# Altium schematic sheet Power.SchDoc: Power
size B; DocumentNumber: 6; SheetNumber: 6; SheetTotal: 11
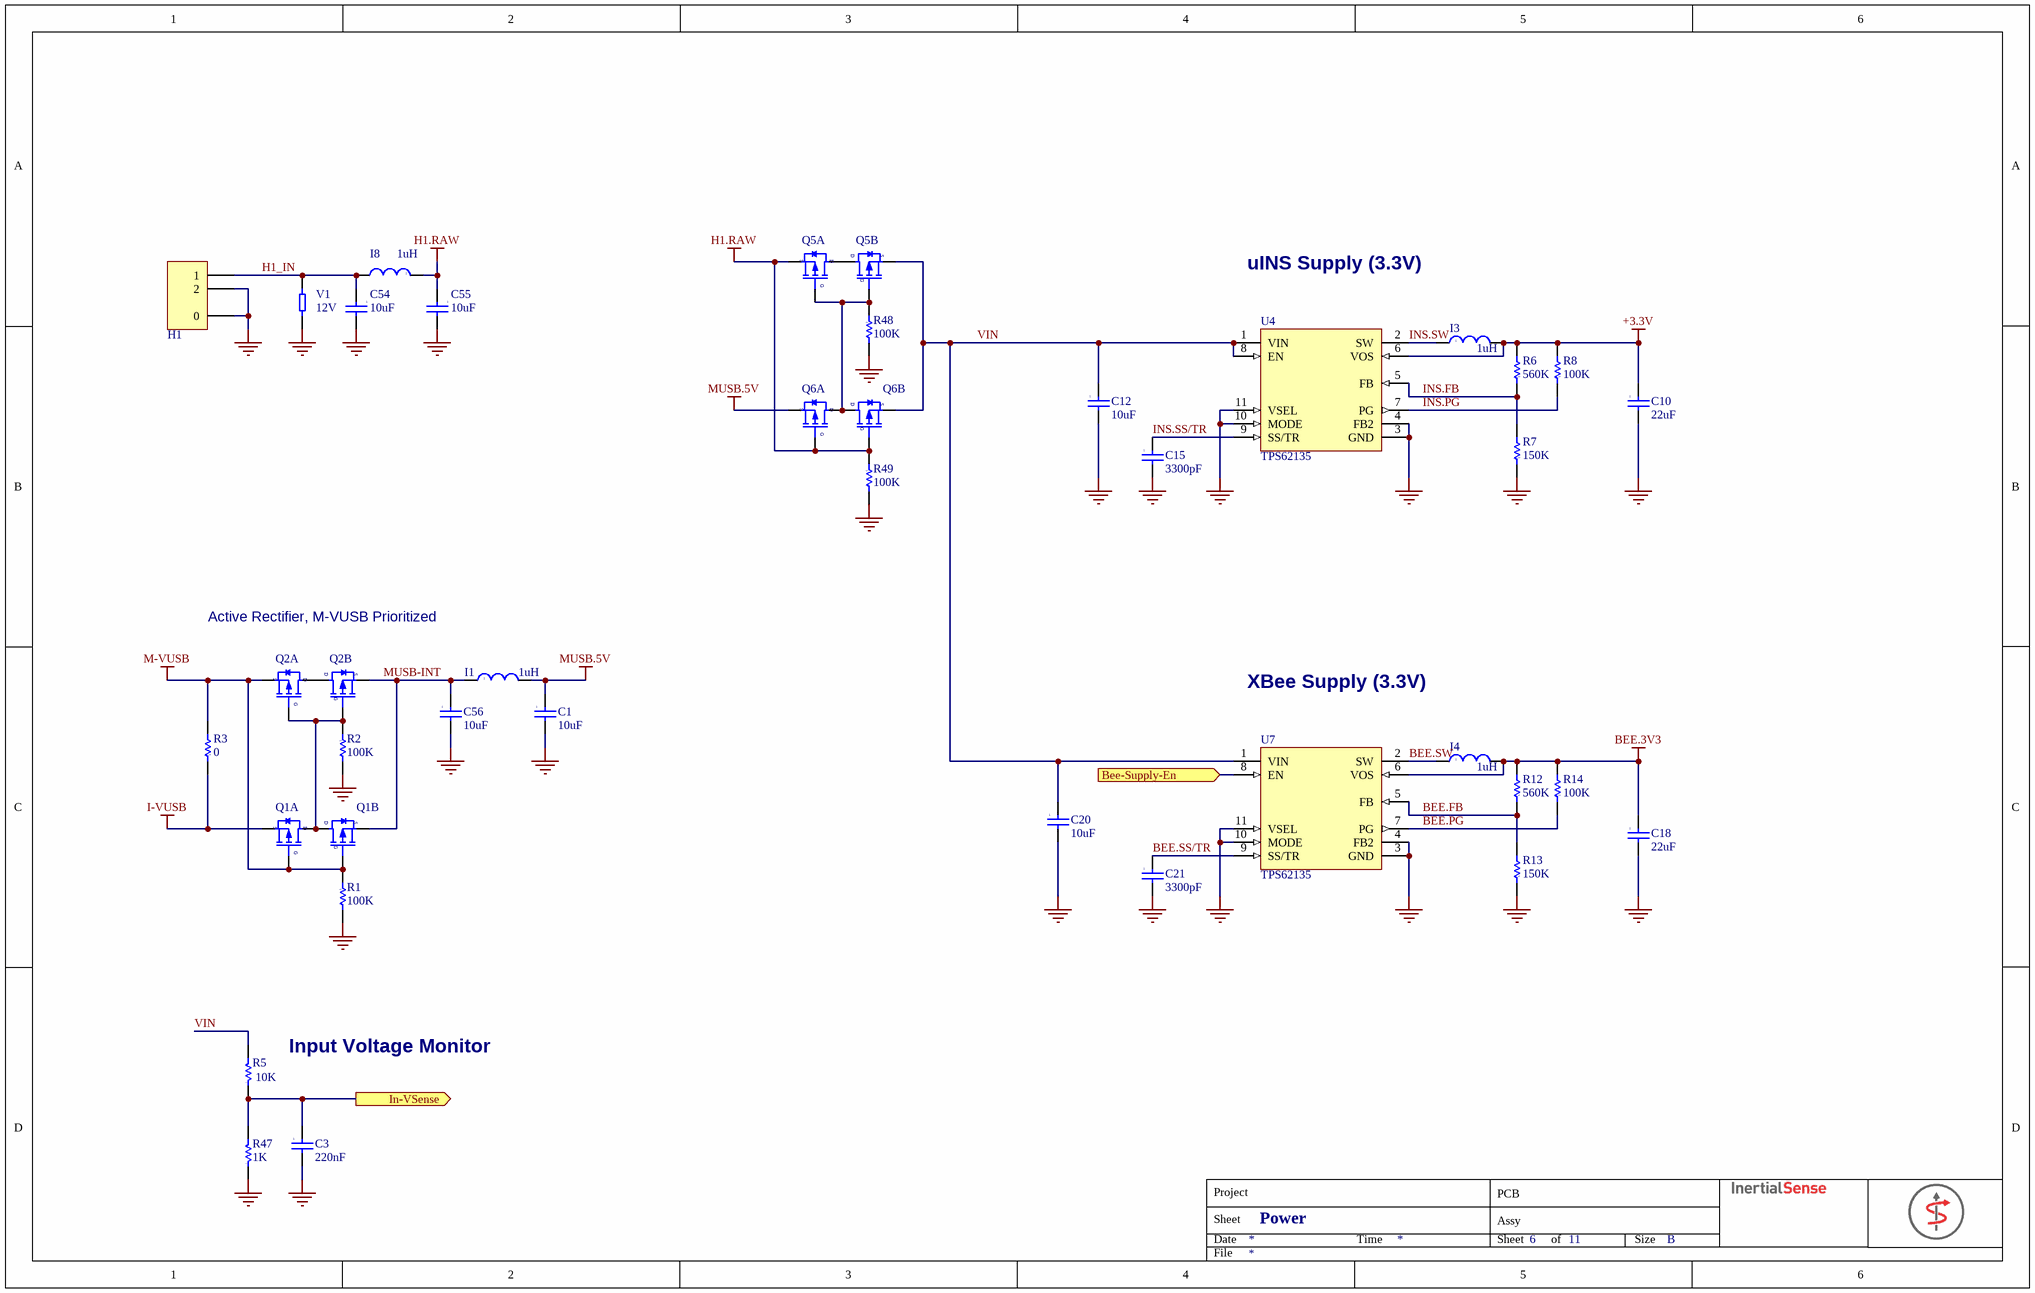
[diagram p0: Power.SchDoc]

## Parts
C1  value 10uF  [0805]  (hidden comment: Cap)
C3  value 220nF  [0402]  (hidden comment: Cap)
C10  value 22uF  [1206]  (hidden comment: Cap)
C12  value 10uF  [0805]  (hidden comment: Cap)
C15  value 3300pF  [0402]  (hidden comment: Cap)
C18  value 22uF  [1206]  (hidden comment: Cap)
C20  value 10uF  [0805]  (hidden comment: Cap)
C21  value 3300pF  [0402]  (hidden comment: Cap)
C54  value 10uF  [0805]  (hidden comment: Cap)
C55  value 10uF  [0805]  (hidden comment: Cap)
C56  value 10uF  [0805]  (hidden comment: Cap)
H1  Hdr - 2pin - mount  [S2B-PH-SM4-TB(LF)(SN)]  (value not drawn)
I1  value 1uH  [INDC2520X12N]  (hidden comment: Inductor)
I3  value 1uH  [INDC2520X12N]  (hidden comment: Inductor)
I4  value 1uH  [INDC2520X12N]  (hidden comment: Inductor)
I8  value 1uH  [INDC2520X12N]  (hidden comment: Inductor)
Q1  MOSFET-P  [TSST8]  (value not drawn)  (parts A,B of 2)
Q2  MOSFET-P  [TSST8]  (value not drawn)  (parts A,B of 2)
Q5  MOSFET-P  [TSST8]  (value not drawn)  (parts A,B of 2)
Q6  MOSFET-P  [TSST8]  (value not drawn)  (parts A,B of 2)
R1  value 100K  [R0402]  (hidden comment: Res)
R2  value 100K  [R0402]  (hidden comment: Res)
R3  value 0  [R0603]  (hidden comment: Res)
R5  value 10K  [R0402]  (hidden comment: Res)
R6  value 560K  [R0402]  (hidden comment: Res)
R7  value 150K  [R0402]  (hidden comment: Res)
R8  value 100K  [R0402]  (hidden comment: Res)
R12  value 560K  [R0402]  (hidden comment: Res)
R13  value 150K  [R0402]  (hidden comment: Res)
R14  value 100K  [R0402]  (hidden comment: Res)
R47  value 1K  [R0402]  (hidden comment: Res)
R48  value 100K  [R0402]  (hidden comment: Res)
R49  value 100K  [R0402]  (hidden comment: Res)
U4  TPS62135  [PQFN50P200X300X100-14N]
U7  TPS62135  [PQFN50P200X300X100-14N]
V1  Voltage Rating (DC): 12V  [R0402]  (hidden comment: Var)

## Ports
Bee-Supply-En (in), In-VSense (out)

## Nets
+3.3V: C10.1 I3.2 R6.2 R8.2 U4.6(VOS)
BEE.3V3: C18.1 I4.2 R12.2 R14.2 U7.6(VOS)
GND: C1.2 C3.2 C10.2 C12.2 C15.2 C18.2 C20.2 C21.2 C54.2 C55.2 C56.2 H1.0 H1.2 R1.2 R2.2 R7.1 R13.1 R47.1 R48.2 R49.2 U4.3(GND) U4.4(FB2) U4.10(MODE) U4.11(VSEL) U7.3(GND) U7.4(FB2) U7.10(MODE) U7.11(VSEL) V1.2
H1.RAW: C55.1 I8.1 Q5.S1(S) Q6.G1(G) Q6.G2(G) R49.1
I-VUSB: Q1.S1(S) R3.1
M-VUSB: Q1.G1(G) Q1.G2(G) Q2.S1(S) R1.1 R3.2
MUSB.5V: C1.1 I1.2 Q6.S1(S)
Bee-Supply-En: U7.8(EN) ; port Bee-Supply-En
BEE.FB: R12.1 R13.2 U7.5(FB)
BEE.PG: R14.1 U7.7(PG)
BEE.SS/TR: C21.1 U7.9(SS/TR)
BEE.SW: I4.1 U7.2(SW)
H1_IN: C54.1 H1.1 I8.2 V1.1
In-VSense: C3.1 R5.1 R47.2 ; port In-VSense
INS.FB: R6.1 R7.2 U4.5(FB)
INS.PG: R8.1 U4.7(PG)
INS.SS/TR: C15.1 U4.9(SS/TR)
INS.SW: I3.1 U4.2(SW)
MUSB-INT: C56.1 I1.1 Q1.S2(S) Q2.S2(S)
VIN: C12.1 C20.1 Q5.S2(S) Q6.S2(S) R5.2 U4.1(VIN) U4.8(EN) U7.1(VIN)
NetQ1_D1: Q1.D1(D) Q1.D2(D) Q2.G1(G) Q2.G2(G) R2.1
NetQ2_D1: Q2.D1(D) Q2.D2(D)
NetQ5_D1: Q5.D1(D) Q5.D2(D)
NetQ5_G1: Q5.G1(G) Q5.G2(G) Q6.D1(D) Q6.D2(D) R48.1

## Notes on the sheet
- uINS Supply (3.3V)
- Active Rectifier, M-VUSB Prioritized
- XBee Supply (3.3V)
- (near R5) Input Voltage Monitor
- Date
- Sheet
- Project
- Time
- PCB
- Assy
- of
- Size
- B
- File

## Library data of the parts
C1 C12 C20 C54-C56 = Cap: CAP CER 10UF 35V X5R 0805; Manufacturer: TDK; Manufacturer Part Number: C2012X5R1V106K085AC; Dielectric Material: Ceramic; Tolerance: 10%; Published: 8-Jun-2000; LatestRevisionDate: 17-Jul-2002; LatestRevisionNote: Re-released for DXP Platform.; Publisher: Altium Limited; Category: Capacitors; Supplier 1: Digi-Key; Supplier Part Number 1: 445-14417-6-ND; Stock 1: 0; Pricing 1: 1=0.83, 10=0.589, 100=0.3881, 500=0.2875, 1000=0.24438 (USD); Mount: Surface Mount; Case/Package: 0805; Weight: 0.000194oz; Case Code (Metric): 2012; Case Code (Imperial): 0805; Min Operating Temperature: -55°C; Max Operating Temperature: 85°C; Package Quantity: 1; Packaging: Tape and Reel; Capacitance: 10uF; Voltage Rating: 35V; Termination: SMD/SMT; Voltage Rating (DC): 35V; Dielectric: X5R; Length: 0.079inch; Height: 0.85mm; Width: 0.049inch; Thickness: 0.039inch; Lead Free: Lead Free; REACH SVHC: No SVHC; ComponentLink1URL: https://datasheet.ciiva.com/14894/tdkmlcccaprange-14894527.pdf; ComponentLink1Description: https://datasheet.ciiva.com/14894/tdkmlcccaprange-14894527.pdf
C3 = Cap: CAP CER 0.22UF 16V X7R 0402; Manufacturer: Murata; Manufacturer Part Number: GRM155R71C224KA12D; Material: Ceramic; Tolerance: 10%; Published: 8-Jun-2000; LatestRevisionDate: 17-Jul-2002; LatestRevisionNote: Re-released for DXP Platform.; Publisher: Altium Limited; Category: Capacitors; Supplier 1: Digi-Key; Supplier Part Number 1: 490-5418-6-ND; Stock 1: 0; Pricing 1: 1=0.15, 10=0.105, 100=0.0494, 500=0.03466, 1000=0.02869, 2500=0.0267, 5000=0.02443 (USD); Mount: Surface Mount; Case/Package: 0402; Case Code (Metric): 1005; Case Code (Imperial): 0402; Min Operating Temperature: -55°C; Max Operating Temperature: 125°C; Capacitance: 220nF; Dielectric: X7R; Package Quantity: 1; Voltage Rating: 16V; Packaging: Tape and Reel; Voltage Rating (DC): 16V; Termination: SMD/SMT; Voltage: 16V; Length: 1mm; Height: 0.5mm; Width: 0.02inch; Thickness: 0.022inch; Depth: 0.5mm; Radiation Hardening: No; REACH SVHC: No SVHC; Lead Free: Lead Free; ComponentLink1URL: https://datasheet.ciiva.com/132/product-132672.pdf; ComponentLink1Description: https://datasheet.ciiva.com/132/product-132672.pdf; ComponentLink2URL: https://datasheet.ciiva.com/18184/getdatasheetpartid-347270-18184668.pdf; ComponentLink2Description: https://datasheet.ciiva.com/18184/getdatasheetpartid-347270-18184668.pdf; ComponentLink3URL: https://datasheet.ciiva.com/29199/454127-da-01-en-vs-kondensator-0402-29199807.pdf; ComponentLink3Description: https://datasheet.ciiva.com/29199/454127-da-01-en-vs-kondensator-0402-29199807.pdf; ComponentLink4URL: https://datasheet.ciiva.com/16624/product-16624533.pdf; ComponentLink4Description: https://datasheet.ciiva.com/16624/product-16624533.pdf; ComponentLink5URL: https://datasheet.ciiva.com/16467/product-16467307.pdf; ComponentLink5Description: https://datasheet.ciiva.com/16467/product-16467307.pdf; ComponentLink6URL: https://datasheet.ciiva.com/48671/product-48671325.pdf; ComponentLink6Description: https://datasheet.ciiva.com/48671/product-48671325.pdf; ComponentLink7URL: https://datasheet.ciiva.com/132/partnumbering-e-01-132670.pdf; ComponentLink7Description: https://datasheet.ciiva.com/132/partnumbering-e-01-132670.pdf; ComponentLink8URL: https://datasheet.ciiva.com/132/partnumbering-e-01-132671.pdf; ComponentLink8Description: https://datasheet.ciiva.com/132/partnumbering-e-01-132671.pdf
C10 C18 = Cap: CAP CER 22UF 10V X5R 1206; Manufacturer: Samsung; Manufacturer Part Number: CL31A226KPHNNNE; Tolerance: 10%; ComponentLink1URL: http://www.murata.com/~/media/webrenewal/products/inductor/chip/tokoproducts/wirewoundmetalalloychiptype/m_dfe252012f.ashx; ComponentLink1Description: http://www.murata.com/~/media/webrenewal/products/inductor/chip/tokoproducts/wirewoundmetalalloychiptype/m_dfe252012f.ashx; ComponentLink2URL: https://www.murata.com/~/media/webrenewal/products/inductor/chip/tokoproducts/wirewoundmetalalloychiptype/m_dfe252012f.ashx; ComponentLink2Description: https://www.murata.com/~/media/webrenewal/products/inductor/chip/tokoproducts/wirewoundmetalalloychiptype/m_dfe252012f.ashx; Supplier 1: Digi-Key; Supplier Part Number 1: 1276-1287-6-ND; Stock 1: 46; Pricing 1: 1=0.42, 10=0.289, 100=0.1638, 500=0.1156, 1000=0.10114 (USD); Mount: Surface Mount; Case/Package: 1206; Case Code (Metric): 3216; Case Code (Imperial): 1206; Min Operating Temperature: -55°C; Max Operating Temperature: 85°C; Packaging: Tape and Reel; Package Quantity: 1; Capacitance: 22uF; Voltage Rating: 10V; Dielectric: X5R; Voltage Rating (DC): 10V; Length: 3.2mm; Height: 1.6mm; Width: 0.063inch; Thickness: 0.071inch; Depth: 1.6mm; Radiation Hardening: No; Lead Free: Lead Free; ComponentLink3URL: https://datasheet.ciiva.com/15196/getdatasheetpartid-355211-15196000.pdf; ComponentLink3Description: https://datasheet.ciiva.com/15196/getdatasheetpartid-355211-15196000.pdf; ComponentLink4URL: https://datasheet.ciiva.com/16437/cl05b104kq5nnnc-16437214.pdf; ComponentLink4Description: https://datasheet.ciiva.com/16437/cl05b104kq5nnnc-16437214.pdf
C15 C21 = Cap: CAP CER 0.0033UF 50V X7R 0402; Manufacturer: Samsung; Manufacturer Part Number: CL05B332JB5NNNC; Capacitance: 3.3nF; Tolerance: 5%; ComponentLink1URL: https://datasheet.ciiva.com/25737/cl05b333ka5nnnc-25737430.pdf; ComponentLink1Description: https://datasheet.ciiva.com/25737/cl05b333ka5nnnc-25737430.pdf; Supplier 1: Digi-Key; Supplier Part Number 1: 1276-1548-6-ND; Stock 1: 99431; Pricing 1: 1=0.1, 10=0.064, 100=0.0285, 500=0.02034, 1000=0.01598, 2500=0.01453, 5000=0.01337 (USD); Mount: Surface Mount; Case/Package: 0402; Case Code (Metric): 1005; Case Code (Imperial): 0402; Min Operating Temperature: -55°C; Max Operating Temperature: 125°C; Package Quantity: 1; Packaging: Tape and Reel; Voltage Rating: 50V; Dielectric: X7R; Voltage Rating (DC): 50V; Length: 1mm; Height: 0.5mm; Width: 0.02inch; Thickness: 0.022inch; Depth: 0.5mm; Radiation Hardening: No; ComponentLink2URL: http://www.samsungsem.com/kr/support/product-search/mlcc/CL05B332JB5NNNC.jsp; ComponentLink2Description: http://www.samsungsem.com/kr/support/product-search/mlcc/CL05B332JB5NNNC.jsp
H1 = Hdr - 2pin - mount: CONN HEADER PH SIDE 2POS 2MM SMD; Manufacturer: JST; Current Rating: 2A; Voltage Rating: 100V; Number of Positions: 2; Insulation Resistance: 1GR; Gender: Male; Contact Resistance: 20mR; Connector Type: Male Pin; Supplier 1: Digi-Key; Supplier Part Number 1: 455-1749-1-ND; Manufacturer Part Number: S2B-PH-SM4-TB(LF)(SN); Stock 1: 160048; Pricing 1: 1=0.58, 10=0.547, 100=0.4194, 500=0.3647 (USD); Mount: Surface Mount; Contact Plating: Copper,Tin; Contact Material: Brass,Bronze,Copper Alloy,Tin; Colour: Natural,White; Housing Colour: Beige; Housing Material: Polyamide; Min Operating Temperature: -25°C; Max Operating Temperature: 85°C; Number of Rows: 1; Termination: Solder; Voltage Rating (AC): 100V; Packaging: Tape and Reel; Number of Poles: 2; Max Current Rating: 2A; Fastening Type: Detent; Number of Contacts: 2; Working Voltage: 100V; Max Voltage Rating (AC): 100V; Max Voltage Rating (DC): 100V; Orientation: Right Angle; Length: 7.9mm; Height: 9.4mm; Width: 5mm; Pitch: 2mm; Lead Pitch: 2mm; Contact Mating Length: 0.13inch; Depth: 7.6mm; REACH SVHC: No SVHC; Lead Free: Lead Free; Flammability Rating: UL94 V-0
I1 I3 I4 I8 = Inductor: FIXED IND 1UH 3.3A 40 MOHM; Manufacturer: Murata; Manufacturer Part Number: DFE252012F-1R0M=P2; Core Material: Ferrite; Saturation Current: 5.3A; Shielding: Shielded; DC Resistance (DCR): 40mR; Test Frequency: 1MHz; Tolerance: 20%; Supplier 1: Digi-Key; Supplier Part Number 1: 490-13053-6-ND; Stock 1: 122372; Pricing 1: 1=0.67, 10=0.584, 100=0.4169, 500=0.35018, 1000=0.28348 (USD); Mount: Surface Mount; Case/Package: 1008; Case Code (Metric): 2520; Case Code (Imperial): 1008; Min Operating Temperature: -40°C; Max Operating Temperature: 125°C; Packaging: Tape and Reel; Inductance: 1uh; Current Rating: 3.3A; Length: 0.098inch; Width: 0.079inch; Height - Seated (Max): 0.047inch; ComponentLink1URL: http://www.murata.com/~/media/webrenewal/products/inductor/chip/tokoproducts/wirewoundmetalalloychiptype/m_dfe252012f.ashx; ComponentLink1Description: http://www.murata.com/~/media/webrenewal/products/inductor/chip/tokoproducts/wirewoundmetalalloychiptype/m_dfe252012f.ashx; ComponentLink2URL: https://www.murata.com/~/media/webrenewal/products/inductor/chip/tokoproducts/wirewoundmetalalloychiptype/m_dfe252012f.ashx; ComponentLink2Description: https://www.murata.com/~/media/webrenewal/products/inductor/chip/tokoproducts/wirewoundmetalalloychiptype/m_dfe252012f.ashx
Q1 Q2 Q5 Q6 = MOSFET-Dual-P: 4V DRIVE PCH+PCH MOSFET; Manufacturer: Rohm; Manufacturer Part Number: TT8J3TR; Rise Time: 12ns; Rds On Max: 84mR; Nominal Vgs: -1.5V; Number of Elements: 2; Max Power Dissipation: 1.25W; Drain to Source Voltage (Vdss): 30V; Power Dissipation: 1.1W; Turn-Off Delay Time: 32ns; Continuous Drain Current (ID): 2.5A; Turn-On Delay Time: 5.5ns; Drain to Source Breakdown Voltage: -30V; Gate to Source Voltage (Vgs): 20V; Element Configuration: Dual; Voltage Rating (DC): -20V; Current Rating: -6A; On-State Resistance: 64MR; Supplier 1: Digi-Key; Supplier Part Number 1: TT8J3TRCT-ND; Stock 1: 30988; Pricing 1: 1=0.59, 10=0.493, 100=0.3696, 500=0.27102, 1000=0.20942 (USD); Number of Pins: 8; Weight: 0.01lb; Min Operating Temperature: -55°C; Max Operating Temperature: 150°C; Package Quantity: 3000; Packaging: Tape and Reel; Drain to Source Resistance: 84mR; Threshold Voltage: -1.5V; Length: 3.1mm; Height: 1.1mm; Width: 1.7mm; Radiation Hardening: No; REACH SVHC: No SVHC; Lead Free: Lead Free
R1 R2 R8 R14 R48 R49 = Res: RES SMD 100K OHM 1% 1/16W 0402; Manufacturer: Panasonic; Manufacturer Part Number: ERJ-2RKF1003X; Resistance: 100kR; Temperature Coefficient: 100ppm/°C; Power Rating: 100mW; Voltage Rating: 50V; Supplier 1: Digi-Key; Supplier Part Number 1: P100KLDKR-ND; Stock 1: 6572; Pricing 1: 1=0.1, 10=0.045, 100=0.0184, 1000=0.00826, 2500=0.00717, 5000=0.00593 (USD); Mount: Surface Mount; Case/Package: 0402; Number of Pins: 2; Contact Plating: Tin; Case Code (Imperial): 0402; Case Code (Metric): 1005; Min Operating Temperature: -55°C; Max Operating Temperature: 155°C; Tolerance: 1%; Composition: Thick Film; Packaging: Tape and Reel; Package Quantity: 1; Termination: SMD/SMT; Number of Terminations: 2; Military Standard: Not; Max Power Dissipation: 100mW; Voltage Rating (DC): 50V; Features: Automotive AEC-Q200; Length: 1mm; Height: 0.35mm; Width: 0.5mm; Depth: 0.5mm; Radiation Hardening: No; REACH SVHC: No SVHC; Lead Free: Lead Free
  R1 R2 R48 R49: ComponentLink1URL: http://www.seielect.com/Catalog/SEI-RMCF_RMCP.pdf; ComponentLink1Description: http://www.seielect.com/Catalog/SEI-RMCF_RMCP.pdf
  R8 R14: ComponentLink1URL: https://datasheet.ciiva.com/2453/pyu-r-int-thick-7-2453361.pdf; ComponentLink1Description: https://datasheet.ciiva.com/2453/pyu-r-int-thick-7-2453361.pdf; ComponentLink2URL: https://datasheet.ciiva.com/2453/pyu-r-int-thick-7-2453362.pdf; ComponentLink2Description: https://datasheet.ciiva.com/2453/pyu-r-int-thick-7-2453362.pdf; ComponentLink3URL: https://datasheet.ciiva.com/2453/pyu-r-int-thick-7-2453363.pdf; ComponentLink3Description: https://datasheet.ciiva.com/2453/pyu-r-int-thick-7-2453363.pdf; ComponentLink4URL: https://datasheet.ciiva.com/22747/1018594-22747509.pdf; ComponentLink4Description: https://datasheet.ciiva.com/22747/1018594-22747509.pdf; ComponentLink5URL: https://datasheet.ciiva.com/15189/getdatasheetpartid-323696-15189334.pdf; ComponentLink5Description: https://datasheet.ciiva.com/15189/getdatasheetpartid-323696-15189334.pdf; ComponentLink6URL: https://datasheet.ciiva.com/16740/pyu-rc0402-51-rohs-l-6-r-16740567.pdf; ComponentLink6Description: https://datasheet.ciiva.com/16740/pyu-rc0402-51-rohs-l-6-r-16740567.pdf; ComponentLink7URL: https://datasheet.ciiva.com/12667/pyu-rc0402-51-rohs-l-6-r-12667930.pdf; ComponentLink7Description: https://datasheet.ciiva.com/12667/pyu-rc0402-51-rohs-l-6-r-12667930.pdf; ComponentLink8URL: https://datasheet.ciiva.com/11819/0900766b80c66297-11819452.pdf; ComponentLink8Description: https://datasheet.ciiva.com/11819/0900766b80c66297-11819452.pdf
R3 = Res: RES SMD 0 OHM JUMPER 1/10W 0603; Manufacturer: Yageo; Manufacturer Part Number: RC0603JR-070RL; Resistance: 0mR; Power Rating: 100mW; Voltage Rating (DC): 50V; Tolerance: 1%; Temperature Coefficient: 200ppm/°C; Supplier 1: Digi-Key; Supplier Part Number 1: 311-0.0GRDKR-ND; Stock 1: 7565242; Pricing 1: 1=0.1, 10=0.021, 25=0.0152, 50=0.0114, 100=0.0084, 250=0.00644, 500=0.00514, 1000=0.00379 (USD); Case/Package: 0603; Number of Pins: 2; Case Code (Imperial): 0603; Case Code (Metric): 1608; Contact Plating: Matte,Tin; Min Operating Temperature: -55°C; Max Operating Temperature: 155°C; Packaging: Tape and Reel; Composition: Thick Film; Military Standard: Not; Package Quantity: 5000; Voltage Rating: 50V; Termination: SMD/SMT; Length: 1.6mm; Height: 0.45mm; Width: 0.8mm; Depth: 0.8mm; Radiation Hardening: No; Lead Free: Lead Free; REACH SVHC: No SVHC
R5 = Res: RES 10K OHM 1/16W 1% 0402 SMD; Manufacturer: Panasonic; Manufacturer Part Number: ERJ-2RKF1002X; Resistance: 10kR; Temperature Coefficient: 100ppm/°C; Power Rating: 100mW; Voltage Rating: 50V; LatestRevisionDate: 2-Dec-2009; ComponentLink1URL: http://www.yageo.com/documents/recent/PYu-RC0402_51_RoHS_L_6.pdf; ComponentLink1Description: http://www.yageo.com/documents/recent/PYu-RC0402_51_RoHS_L_6.pdf; Supplier 1: Digi-Key; Supplier Part Number 1: P10.0KLDKR-ND; Stock 1: 28312782; Pricing 1: 1=0.1, 10=0.045, 100=0.0184, 1000=0.00826, 2500=0.00717, 5000=0.00593 (USD); Mount: Surface Mount; Case/Package: 0402; Number of Pins: 2; Contact Plating: Tin; Case Code (Metric): 1005; Case Code (Imperial): 0402; Min Operating Temperature: -55°C; Max Operating Temperature: 155°C; Tolerance: 1%; Composition: Thick Film; Packaging: Tape and Reel; Package Quantity: 1; Number of Terminations: 2; Termination: SMD/SMT; Military Standard: Not; Max Power Dissipation: 100mW; Voltage Rating (DC): 50V; Features: Automotive AEC-Q200; Length: 1mm; Height: 0.35mm; Width: 0.02inch; Depth: 0.5mm; Radiation Hardening: No; REACH SVHC: No SVHC; Lead Free: Lead Free
R6 R12 = Res: RES SMD 560K OHM 1% 1/10W 0402; Manufacturer: Panasonic; Manufacturer Part Number: ERJ-2RKF5603X; Resistance: 560kR; Power Rating: 100mW; Voltage Rating: 50V; Temperature Coefficient: 100ppm/°C; Supplier 1: Digi-Key; Supplier Part Number 1: P560KLDKR-ND; Stock 1: 227984; Pricing 1: 1=0.1, 10=0.056, 100=0.0227, 1000=0.01021, 2500=0.00886, 5000=0.00732 (USD); Mount: Surface Mount; Case/Package: 0402; Number of Pins: 2; Case Code (Metric): 1005; Case Code (Imperial): 0402; Contact Plating: Tin; Min Operating Temperature: -55°C; Max Operating Temperature: 155°C; Tolerance: 1%; Packaging: Tape and Reel; Package Quantity: 1; Composition: Thick Film; Number of Terminations: 2; Termination: SMD/SMT; Military Standard: Not; Max Power Dissipation: 100mW; Voltage Rating (DC): 50V; Features: Automotive AEC-Q200; Length: 1mm; Height: 0.35mm; Width: 0.02inch; Depth: 0.5mm; Radiation Hardening: No; REACH SVHC: No SVHC; ComponentLink1URL: https://datasheet.ciiva.com/17204/aoa0000ce2-17204757.pdf; ComponentLink1Description: https://datasheet.ciiva.com/17204/aoa0000ce2-17204757.pdf; ComponentLink2URL: https://datasheet.ciiva.com/6075/aoa0000ce2-6075366.pdf; ComponentLink2Description: https://datasheet.ciiva.com/6075/aoa0000ce2-6075366.pdf; ComponentLink3URL: https://datasheet.ciiva.com/16771/70260748-16771559.pdf; ComponentLink3Description: https://datasheet.ciiva.com/16771/70260748-16771559.pdf; ComponentLink4URL: https://datasheet.ciiva.com/22687/1678782-22687463.pdf; ComponentLink4Description: https://datasheet.ciiva.com/22687/1678782-22687463.pdf; ComponentLink5URL: https://datasheet.ciiva.com/7710/aoa0000ce2-7710746.pdf; ComponentLink5Description: https://datasheet.ciiva.com/7710/aoa0000ce2-7710746.pdf; ComponentLink6URL: https://datasheet.ciiva.com/11821/0900766b80f80784-11821338.pdf; ComponentLink6Description: https://datasheet.ciiva.com/11821/0900766b80f80784-11821338.pdf; ComponentLink7URL: https://datasheet.ciiva.com/24026/aoa0000ce2-24026571.pdf; ComponentLink7Description: https://datasheet.ciiva.com/24026/aoa0000ce2-24026571.pdf; ComponentLink8URL: https://datasheet.ciiva.com/16758/70260748-16758700.pdf; ComponentLink8Description: https://datasheet.ciiva.com/16758/70260748-16758700.pdf; ComponentLink9URL: https://datasheet.ciiva.com/9181/aoa0000ce2-9181118.pdf; ComponentLink9Description: https://datasheet.ciiva.com/9181/aoa0000ce2-9181118.pdf
R7 R13 = Res: RES SMD 150K OHM 1% 1/10W 0402; Manufacturer: Panasonic; Manufacturer Part Number: ERJ-2RKF1503X; Resistance: 150kR; Power Rating: 100mW; Voltage Rating: 50V; Temperature Coefficient: 100ppm/°C; Supplier 1: Digi-Key; Supplier Part Number 1: P150KLDKR-ND; Stock 1: 322631; Pricing 1: 1=0.1, 10=0.056, 100=0.0227, 1000=0.01021, 2500=0.00886, 5000=0.00732 (USD); Mount: Surface Mount; Case/Package: 0402; Number of Pins: 2; Weight: 2.8E-05oz; Case Code (Imperial): 0402; Case Code (Metric): 1005; Contact Plating: Tin; Min Operating Temperature: -55°C; Max Operating Temperature: 155°C; Tolerance: 1%; Packaging: Tape and Reel; Package Quantity: 1; Composition: Thick Film; Termination: SMD/SMT; Number of Terminations: 2; Military Standard: Not; Max Power Dissipation: 100mW; Voltage Rating (DC): 50V; Features: Automotive AEC-Q200; Length: 1mm; Height: 0.35mm; Width: 0.5mm; Depth: 0.5mm; Radiation Hardening: No; REACH SVHC: No SVHC; Lead Free: Lead Free; ComponentLink1URL: https://datasheet.ciiva.com/11821/0900766b80f80784-11821185.pdf; ComponentLink1Description: https://datasheet.ciiva.com/11821/0900766b80f80784-11821185.pdf; ComponentLink2URL: https://datasheet.ciiva.com/7909/426256-7909541.pdf; ComponentLink2Description: https://datasheet.ciiva.com/7909/426256-7909541.pdf; ComponentLink3URL: https://datasheet.ciiva.com/22673/1678782-22673269.pdf; ComponentLink3Description: https://datasheet.ciiva.com/22673/1678782-22673269.pdf; ComponentLink4URL: https://datasheet.ciiva.com/16768/70260748-16768198.pdf; ComponentLink4Description: https://datasheet.ciiva.com/16768/70260748-16768198.pdf; ComponentLink5URL: https://datasheet.ciiva.com/16426/aoa0000ce2-16426743.pdf; ComponentLink5Description: https://datasheet.ciiva.com/16426/aoa0000ce2-16426743.pdf; ComponentLink6URL: https://datasheet.ciiva.com/43467/1678782-43467495.pdf; ComponentLink6Description: https://datasheet.ciiva.com/43467/1678782-43467495.pdf; ComponentLink7URL: https://datasheet.ciiva.com/28547/1678782-28547178.pdf; ComponentLink7Description: https://datasheet.ciiva.com/28547/1678782-28547178.pdf; ComponentLink8URL: https://datasheet.ciiva.com/6137/aoa0000ce2-6137547.pdf; ComponentLink8Description: https://datasheet.ciiva.com/6137/aoa0000ce2-6137547.pdf; ComponentLink9URL: https://datasheet.ciiva.com/7909/aoa0000ce2-7909181.pdf; ComponentLink9Description: https://datasheet.ciiva.com/7909/aoa0000ce2-7909181.pdf
R47 = Res: RES 1.00K OHM 1/16W 1% 0402 SMD; Manufacturer: Yageo; Manufacturer Part Number: RC0402FR-071KL; Power (Watts): 0.063W, 1/16W; Temperature Coefficient: ±100ppm/°C; LatestRevisionDate: 2-Dec-2009; Supplier 1: Digi-Key; Supplier Part Number 1: 311-1.00KLRCT-ND; RoHS: RoHS Compliant; Category: Resistors; Stock 1: 3222170; Pricing 1: 1=0.1, 10=0.014, 100=0.0063, 500=0.00382, 1000=0.0027, 5000=0.00203 (USD); Resistance (Ohms): 1k; Composition: Thick Film; Features: -; Tolerance: ±1%; Package / Case: 0402 (1005 Metric); Size / Dimension: 0.039" L x 0.020" W (1.00mm x 0.50mm); Height: 0.016" (0.40mm); Number of Terminations: 2; Packaging: Cut Tape (CT); ComponentLink1URL: http://www.yageo.com/documents/recent/PYu-RC0402_51_RoHS_L_6.pdf; ComponentLink1Description: http://www.yageo.com/documents/recent/PYu-RC0402_51_RoHS_L_6.pdf
U4 U7 = TPS62135: IC REG BUCK ADJ 3.5A 11VQFN; Manufacturer: Texas Instruments; Manufacturer Part Number: TPS62135RGXR; Number of Outputs: 1; Min Input Voltage: 3V; Max Input Voltage: 17V; Min Output Voltage: 800mV; Max Output Voltage: 12V; Switching Frequency: 2.5MHz; Synchronous Rectifier: Yes; Quiescent Current: 18uA; Supplier 1: Digi-Key; Supplier Part Number 1: 296-47242-6-ND; Stock 1: 24851; Pricing 1: 1=2.35, 10=2.113, 100=1.6981, 500=1.39514, 1000=1.15597 (USD); Mount: Surface Mount; Number of Pins: 11; Min Operating Temperature: -40°C; Max Operating Temperature: 125°C; Packaging: Tape and Reel; Output Current: 3.5A; Lead Free: Lead Free
V1 = Var: VARISTOR 0402; Manufacturer: Bourns; Manufacturer Part Number: CG0402MLC-12LG; Capacitance: 0.5pF; Number of Circuits: 1; Clamping Voltage: 25V; Current Rating: 5nA; Element Configuration: Single; Response Time: 1ns; Supplier 1: Digi-Key; Supplier Part Number 1: CG0402MLC-12LGCT-ND; Stock 1: 27475; Pricing 1: 1=0.44, 10=0.341, 25=0.288, 100=0.2343, 250=0.19416, 500=0.16068, 1000=0.12051, 2500=0.11047, 5000=0.10377 (USD); Mount: Surface Mount; Case/Package: 0402; Number of Pins: 2; Case Code (Metric): 1005; Case Code (Imperial): 0402; Contact Plating: Tin; Min Operating Temperature: -40°C; Max Operating Temperature: 85°C; Packaging: Tape and Reel; Operating Supply Voltage: 12V; Package Quantity: 1; Max Voltage Rating (DC): 12V; Number of Channels: 1; Termination: SMD/SMT; Voltage: 12V; Leakage Current: 5nA; Working Voltage: 12V; Voltage Rating: 12V; Length: 1mm; Width: 0.5mm; Depth: 0.5mm; Radiation Hardening: No; REACH SVHC: No SVHC